# Altium project 遥控器控制板.PrjPcb
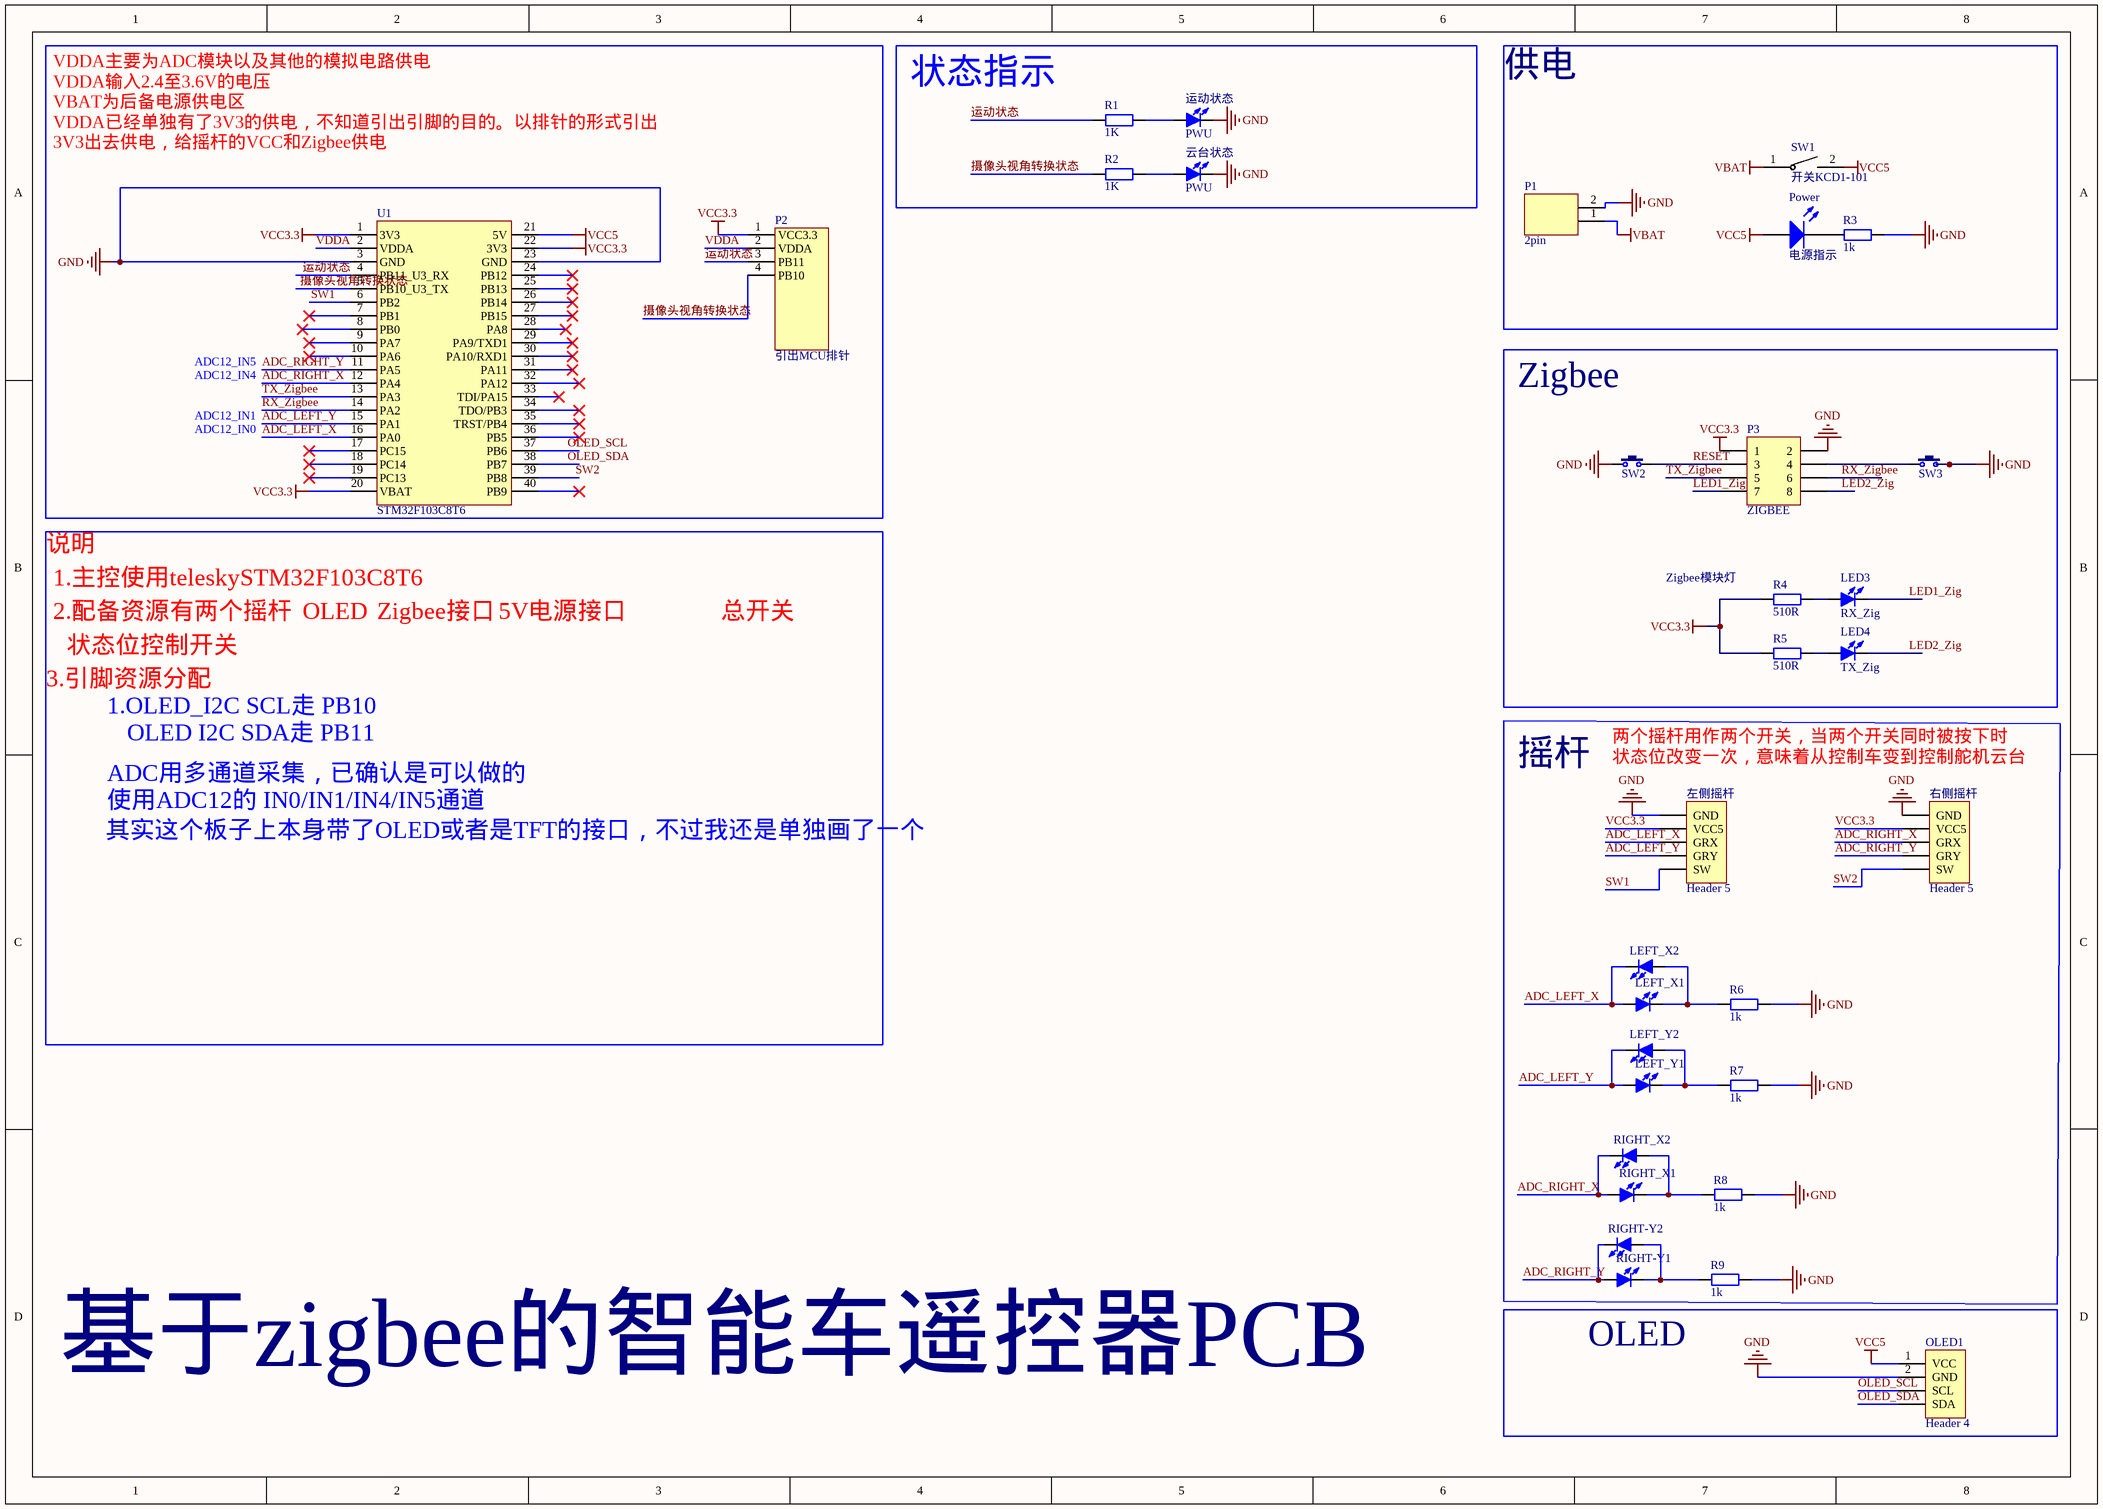
[diagram p0: 控制板原理图.SchDoc]
1 sheet, 32 parts. Net scope: global (net labels, ports and power ports of the same name join across sheets).
Board file: 遥控器PCB.PcbDoc

## Sheet 控制板原理图.SchDoc
size A3

### Parts
LED3  RX_Zig  [LED 0805B]
LED4  TX_Zig  [LED 0805B]
LEFT_X1  TX_Zig  [LED 0805B]  (value not drawn)
LEFT_X2  TX_Zig  [LED 0805B]  (value not drawn)
LEFT_Y1  TX_Zig  [LED 0805B]  (value not drawn)
LEFT_Y2  TX_Zig  [LED 0805B]  (value not drawn)
OLED1  Header 4  [HDR1X4]
P1  2pin  [DC-050-5.5*2.1_贴片]
P2  引出MCU排针  [接插件_排母_4*1]
P3  ZIGBEE  [DRF1609H-DIP]
Power  电源指示  [LED 0805B]
R1  1K  [R 0805_M]
R2  1K  [R 0805_M]
R3  1k  [R 0805_M]
R4  510R  [R 0805_M]
R5  510R  [R 0805_M]
R6  1k  [R 0805_M]
R7  1k  [R 0805_M]
R8  1k  [R 0805_M]
R9  1k  [R 0805_M]
RIGHT-Y1  TX_Zig  [LED 0805B]  (value not drawn)
RIGHT-Y2  TX_Zig  [LED 0805B]  (value not drawn)
RIGHT_X1  TX_Zig  [LED 0805B]  (value not drawn)
RIGHT_X2  TX_Zig  [LED 0805B]  (value not drawn)
SW1  开关KCD1-101  [开关KCD1-101]
SW2  ZigReset  [SW DIP-6*6*5]  (value not drawn)
SW3  ZigReset  [SW DIP-6*6*5]  (value not drawn)
U1  STM32F103C8T6  [STM32F103C8T6]
云台状态  PWU  [LED 0805R]
右侧摇杆  Header 5  [HDR1X5]
左侧摇杆  Header 5  [HDR1X5]
运动状态  PWU  [LED 0805R]

### Blocks framed on the sheet
状态指示: R1 R2 云台状态 运动状态
供电: P1 Power R3 SW1
Zigbee: LED3 LED4 P3 R4 R5 SW2 SW3
摇杆: LEFT_X1 LEFT_X2 LEFT_Y1 LEFT_Y2 R6-R9 RIGHT-Y1 RIGHT-Y2 RIGHT_X1 RIGHT_X2 右侧摇杆 左侧摇杆
OLED: OLED1

### Nets
GND: OLED1.2(GND) P1.2 P3.2 R3.1 R6.1 R7.1 R8.1 R9.1 SW2.1 SW3.2 U1.3(GND) U1.23(GND) 云台状态.2(K) 右侧摇杆.1(GND) 左侧摇杆.1(GND) 运动状态.2(K)
VBAT: P1.1 SW1.1
VCC3.3: P2.1(VCC3.3) P3.1 R4.2 R5.2 U1.1(3V3) U1.20(VBAT) U1.22(3V3) 右侧摇杆.2(VCC5) 左侧摇杆.2(VCC5)
VCC5: OLED1.1(VCC) Power.1(A) SW1.2 U1.21(5V)
ADC_LEFT_X: LEFT_X1.1(A) LEFT_X2.2(K) U1.16(PA0) 左侧摇杆.3(GRX)
ADC_LEFT_Y: LEFT_Y1.1(A) LEFT_Y2.2(K) U1.15(PA1) 左侧摇杆.4(GRY)
ADC_RIGHT_X: RIGHT_X1.1(A) RIGHT_X2.2(K) U1.12(PA4) 右侧摇杆.3(GRX)
ADC_RIGHT_Y: RIGHT-Y1.1(A) RIGHT-Y2.2(K) U1.11(PA5) 右侧摇杆.4(GRY)
LED1_Zig: LED3.2(K) P3.7
LED2_Zig: LED4.2(K) P3.8
OLED_SCL: OLED1.3(SCL) U1.37(PB6)
OLED_SDA: OLED1.4(SDA) U1.38(PB7)
RESET: P3.3 SW2.2
RX_Zigbee: P3.6 U1.14(PA2)
SW1: U1.6(PB2) 左侧摇杆.5(SW)
SW2: U1.39(PB8) 右侧摇杆.5(SW)
TX_Zigbee: P3.5 U1.13(PA3)
VDDA: P2.2(VDDA) U1.2(VDDA)
摄像头视角转换状态: P2.4(PB10) R2.1 U1.5(PB10_U3_TX)
运动状态: P2.3(PB11) R1.1 U1.4(PB11_U3_RX)
NetLED3_1: LED3.1(A) R4.1
NetLED4_1: LED4.1(A) R5.1
NetLEFT_X1_2: LEFT_X1.2(K) LEFT_X2.1(A) R6.2
NetLEFT_Y1_2: LEFT_Y1.2(K) LEFT_Y2.1(A) R7.2
NetP3_4: P3.4 SW3.1
NetPower_2: Power.2(K) R3.2
NetR1_2: R1.2 运动状态.1(A)
NetR2_2: R2.2 云台状态.1(A)
NetR8_2: R8.2 RIGHT_X1.2(K) RIGHT_X2.1(A)
NetR9_2: R9.2 RIGHT-Y1.2(K) RIGHT-Y2.1(A)

Not connected (* = marked no-connect by the designer): U1 7(PB1)* 8(PB0)* 9(PA7)* 10(PA6)* 17(PC15)* 18(PC14)* 19(PC13)* 24(PB12)* 25(PB13)* 26(PB14)* 27(PB15)* 28(PA8)* 29(PA9/TXD1)* 30(PA10/RXD1)* 31(PA11)* 32(PA12)* 33(TDI/PA15)* 34(TDO/PB3)* 35(TRST/PB4)* 36(PB5)* 40(PB9)*

### Notes on the sheet
- VDDA主要为ADC模块以及其他的模拟电路供电
- VDDA输入2.4至3.6V的电压
- VBAT为后备电源供电区
- VDDA已经单独有了3V3的供电，不知道引出引脚的目的。以排针的形式引出
- 3V3出去供电，给摇杆的VCC和Zigbee供电
- ADC12_IN4
- ADC12_IN5
- ADC12_IN0
- ADC12_IN1
- 说明
- 1.主控使用teleskySTM32F103C8T6
- Zigbee模块灯
- 2.配备资源有两个摇杆
- OLED
- Zigbee接口
- 5V电源接口
- 总开关
- 3.引脚资源分配
- 状态位控制开关
- 1.OLED_I2C SCL走 PB10
- ADC用多通道采集，已确认是可以做的
- OLED I2C SDA走 PB11
- 两个摇杆用作两个开关，当两个开关同时被按下时
- (near 左侧摇杆) 状态位改变一次，意味着从控制车变到控制舵机云台
- 其实这个板子上本身带了OLED或者是TFT的接口，不过我还是单独画了一个
- 使用ADC12的 IN0/IN1/IN4/IN5通道
- 基于zigbee的智能车遥控器PCB

### Library data of the parts
LED3 LED4 LEFT_X1 LEFT_X2 LEFT_Y1 LEFT_Y2 RIGHT-Y1 RIGHT-Y2 RIGHT_X1 RIGHT_X2 云台状态 运动状态 = LED-SMD: 贴片LED; 版权归属: 黎明电子style; BOM名称: 贴片LED; 学习资源: https://lmdzstyle.taobao.com/
OLED1 = Header 4: Header, 4-Pin; LatestRevisionDate: 17-Jul-2002; LatestRevisionNote: Re-released for DXP Platform.; Publisher: Altium Limited
P3 = Header 4X2: Zigbee复用; LatestRevisionDate: 17-Jul-2002; LatestRevisionNote: Re-released for DXP Platform.; Publisher: Altium Limited
Power = LED0: Typical INFRARED GaAs LED; Published: 8-Jun-2000; LatestRevisionDate: 08-Jul-2005; LatestRevisionNote: Mech Layer 1 removed.; PackageReference: LED-0; Publisher: Altium Limited; PackageDescription: LED; 2 Leads
R1-R9 = R: 贴片电阻; 版权归属: 黎明电子style; BOM名称: 贴片电阻; 学习资源: https://lmdzstyle.taobao.com/
SW2 SW3 = TSW 3x6: 3x6轻触开关; 版权归属: 黎明电子style; BOM名称: 3x6轻触开关; 学习资源: https://lmdzstyle.taobao.com/
U1 = STM32F103C8T6: telesky家的STM32F103C8T6
右侧摇杆 左侧摇杆 = Header 5: Header, 5-Pin; LatestRevisionDate: 17-Jul-2002; LatestRevisionNote: Re-released for DXP Platform.; Publisher: Altium Limited